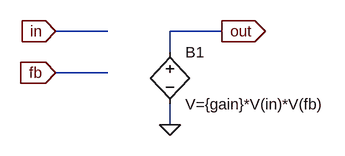
[diagram p0: schematic mult.asc]
mult.asc, the LTspice schematic file:
Version 4
SHEET 1 880 680
WIRE 16 48 -64 48
WIRE 192 48 112 48
WIRE 112 80 112 48
WIRE 16 112 -64 112
WIRE 112 192 112 160
FLAG 112 192 0
FLAG 192 48 out
IOPIN 192 48 Out
FLAG -64 48 in
IOPIN -64 48 In
FLAG -64 112 fb
IOPIN -64 112 In
SYMBOL bv 112 64 R0
SYMATTR InstName B1
SYMATTR Value V={gain}*V(in)*V(fb)

The netlist it stands for:
* mult.asc
B1 out 0 V={gain}*V(in)*V(fb)
.backanno
.end